# EAGLE design irisc (EAGLE 9.2.2)
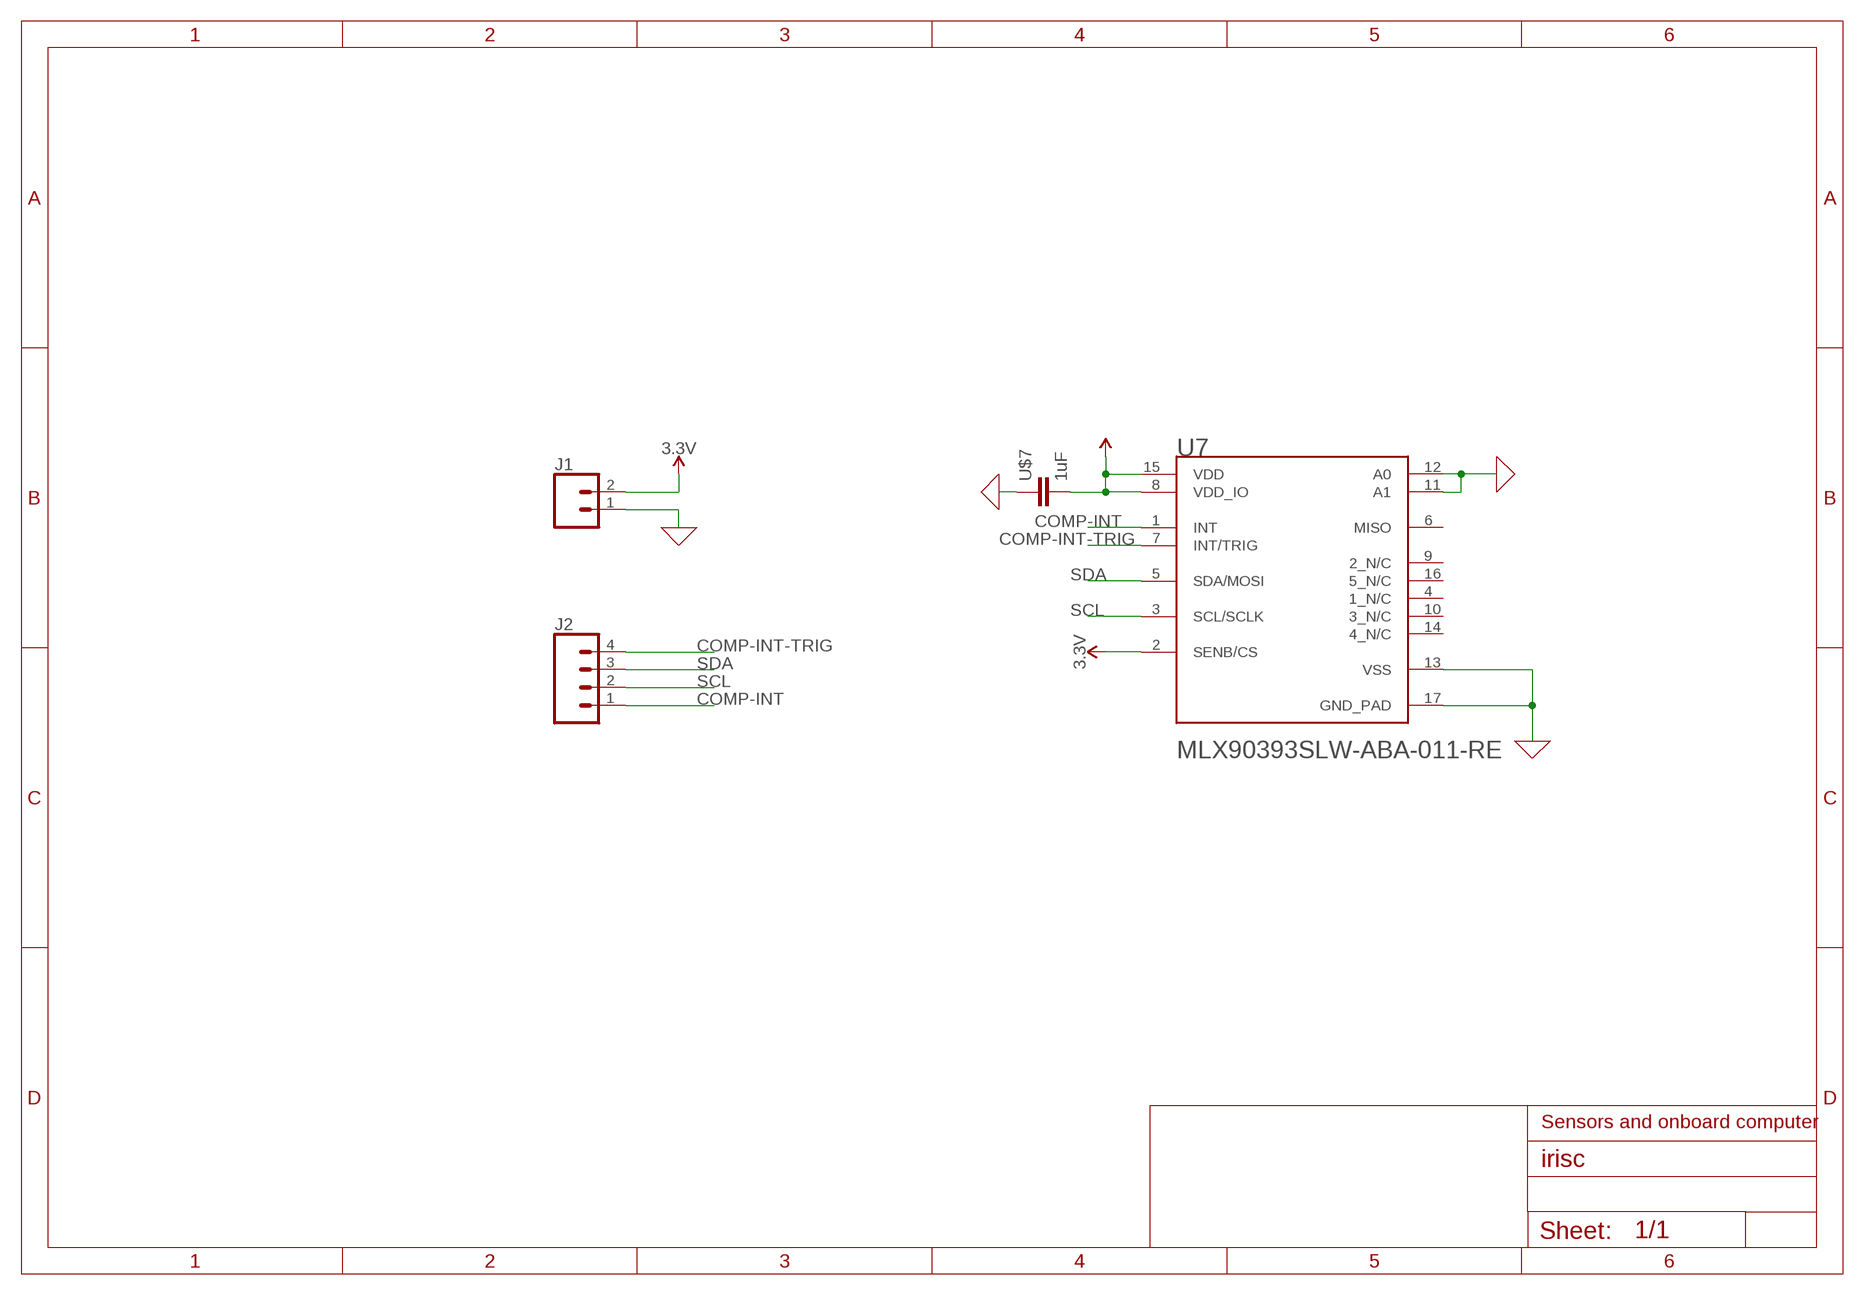
[diagram p0: schematic, sheet 1]

## Parts
J1  CONN_02  [1X02]
J2  CONN_04  [1X04]
U7  MELEXIS_TECHNOLOGIES_MLX90393SLW-ABA-011-REMELEXIS_TECHNOLOGIES_MLX90393SLW-ABA-011-RE_0_0  [MELEXIS_TECHNOLOGIES_MLX90393SLW-ABA-011-RE_0]
U$7  1uF  CAPACITOR_0603_N  [RESC0603_N]

## Nets
0: J1.1 U7.11(A1) U7.12(A0) U7.13(VSS) U7.17(GND_PAD) U$7.1 ; supply symbol labelled GND
3.3V: J1.2 U7.2(SENB/CS) U7.8(VDD_IO) U7.15(VDD) U$7.2
COMP-INT: J2.1 U7.1(INT)
COMP-INT-TRIG: J2.4 U7.7(INT/TRIG)
SCL: J2.2 U7.3(SCL/SCLK)
SDA: J2.3 U7.5(SDA/MOSI)
Unconnected: U7.4(1_N/C) U7.6(MISO) U7.9(2_N/C) U7.10(3_N/C) U7.14(4_N/C) U7.16(5_N/C)

## Notes on the sheet
- Sensors and onboard computer

## Library data of the parts
J1 = SparkFun-Connectors:CONN_02: Multi connection point. Often used as Generic Header-pin footprint for 0.1 inch spaced/style header connections On any of the 0.1 inch spaced packages, you can populate with these: Break Away Headers - Straight <https://www.sparkfun.com/products/116> (PRT-00116) Break Away Male Headers - Right Angle <https://www.sparkfun.com/products/553> (PRT-00553) Female Headers <https://www.sparkfun.com/products/115> (PRT-00115) Break Away Headers - Machine Pin <https://www.sparkfun.com/products/117> (PRT-00117) Break Away Female Headers - Swiss Machine Pin <https://www.sparkfun.com/products/743> (PRT-00743) For SCREWTERMINALS and SPRING TERMINALS visit here: Screw Terimnals on SparkFun.com <https://www.sparkfun.com/search/results?term=Screw+Terminals> (5mm/3.5mm/2.54mm spacing) This device is also useful as a general connection point to wire up your design to another part of your project. Our various solder wires solder well into these plated through hole pads. Hook-Up Wire - Assortment (Stranded, 22 AWG) <https://www.sparkfun.com/products/11375> (PRT-11375) Hook-Up Wire - Assortment (Solid Core, 22 AWG) <https://www.sparkfun.com/products/11367> (PRT-11367) View the entire wire category on our website here <https://www.sparkfun.com/categories/141> Special notes: Molex polarized connector foot print use with: PRT-08233 with associated crimp pins and housings. 2.54_SCREWTERM for use with PRT-10571. 3.5mm Screw Terminal footprints for PRT-08084 5mm Screw Terminal footprints for use with PRT-08432
J2 = SparkFun-Connectors:CONN_04: Multi connection point. Often used as Generic Header-pin footprint for 0.1 inch spaced/style header connections On any of the 0.1 inch spaced packages, you can populate with these: Break Away Headers - Straight <https://www.sparkfun.com/products/116> (PRT-00116) Break Away Male Headers - Right Angle <https://www.sparkfun.com/products/553> (PRT-00553) Female Headers <https://www.sparkfun.com/products/115> (PRT-00115) Break Away Headers - Machine Pin <https://www.sparkfun.com/products/117> (PRT-00117) Break Away Female Headers - Swiss Machine Pin <https://www.sparkfun.com/products/743> (PRT-00743) For SCREWTERMINALS and SPRING TERMINALS visit here: Screw Terimnals on SparkFun.com <https://www.sparkfun.com/search/results?term=Screw+Terminals> (5mm/3.5mm/2.54mm spacing) This device is also useful as a general connection point to wire up your design to another part of your project. Our various solder wires solder well into these plated through hole pads. Hook-Up Wire - Assortment (Stranded, 22 AWG) <https://www.sparkfun.com/products/11375> (PRT-11375) Hook-Up Wire - Assortment (Solid Core, 22 AWG) <https://www.sparkfun.com/products/11367> (PRT-11367) View the entire wire category on our website here <https://www.sparkfun.com/categories/141> Special notes: Molex polarized connector foot print use with SKU : PRT-08231 with associated crimp pins and housings. 1MM SMD Version SKU: PRT-10208; PROD_ID: CONN-09696
U7 = Melexis Technologies - MLX90393SLW-ABA-011-RE:MELEXIS_TECHNOLOGIES_MLX90393SLW-ABA-011-RE: Micropower Triaxis Magnetometer Datasheet; DATASHEET: https://www.melexis.com/-/media/files/documents/datasheets/mlx90393-datasheet-melexis.pdf; DIGIKEY_DESCRIPTION: IC Hall Effect Sensor X, Y, Z Axis 16-QFN (3x3); DIGIKEY_PART_NUMBER: MLX90393SLW-ABA-011-RECT-ND; IPC_LAND_PATTERN_NAME: QFN50P300X300X90-16; LEAD_FREE: yes; MF: Melexis Technologies; MOUSER_PART_NUMBER: 482-90393SLWABA011RE; MPN: MLX90393SLW-ABA-011-RE; PACKAGE: QFN-16; PREFIX: U; ROHS: yes; TEMPERATURE_RANGE_HIGH: +85°C; TEMPERATURE_RANGE_LOW: -20°C
U$7 = Nordic_nRF:CAPACITOR: Generic chip capacitor

## Board
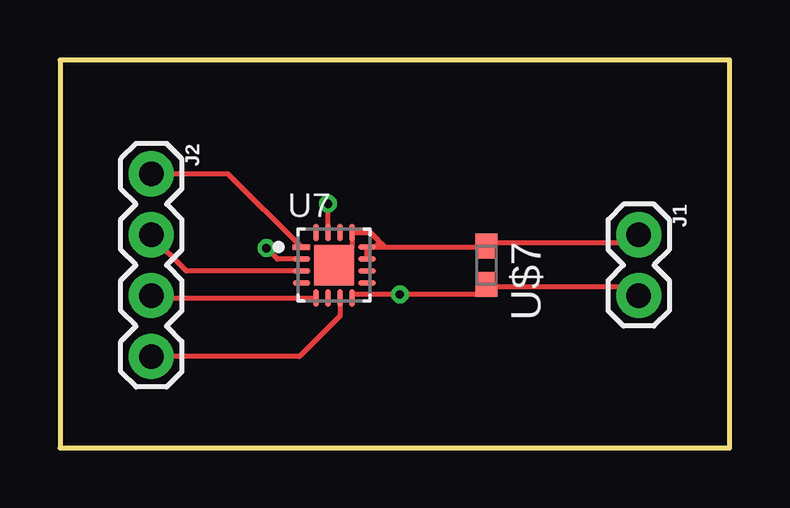
[diagram p1: board, top side]
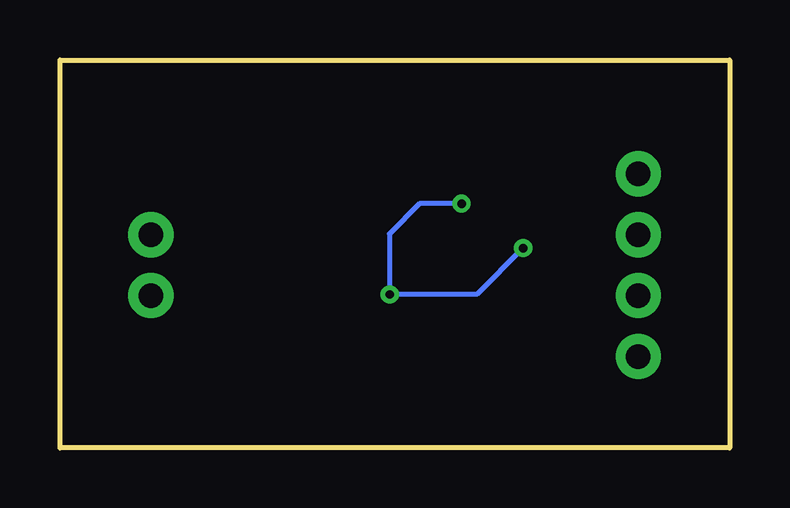
[diagram p2: board, bottom side, seen from below]

Size 27.92 x 16.18 mm. Coordinates in mm from the lower left corner, seen from the top.
Outline: 0,0 27.92,0 27.92,16.18 0,16.18 0,0
Copper layers (1*16): Top 0.035mm / dielectric 1.5mm / Bottom 0.035mm
Design rules "default": minimum track width 6mil, minimum drill 0.35mm, track to track 6mil, track to pad 6mil, pad to pad 6mil, via to via 6mil, smd to smd 6mil, copper to edge 40mil, drill to drill 6mil, minimum pad ring 10mil, minimum via ring 8mil, stop-mask expansion 4mil, vias tented up to drill 0mil, thermal gap 10mil

### Footprints (pad centres in the part's own frame; a part is rotated, then mirrored left to right if it is on the bottom)
1X02 = drill 1.016 pad 1.88: 1 0,0; 2 2.54,0
1X04 = drill 1.016 pad 1.88: 1 0,0; 2 2.54,0; 3 5.08,0; 4 7.62,0
MELEXIS_TECHNOLOGIES_MLX90393SLW-ABA-011-RE_0 = smd 0.74 x 0.239: 1 -1.366,0.75; 2 -1.366,0.25; 3 -1.366,-0.25; 4 -1.366,-0.75; 9 1.366,-0.75; 10 1.366,-0.25; 11 1.366,0.25; 12 1.366,0.75 | smd 0.239 x 0.74: 5 -0.75,-1.366; 6 -0.25,-1.366; 7 0.25,-1.366; 8 0.75,-1.366; 13 0.75,1.365; 14 0.25,1.365; 15 -0.25,1.365; 16 -0.75,1.365 | smd 1.675 x 1.675: 17 0,0
RESC0603_N = smd 1.05 x 0.9: 1 -0.8,0; 2 0.8,0

### Placement (x,y rotation side)
J1  24.13,8.89 270 top
J2  3.81,11.43 270 top
U7  11.43,7.62 0 top
U$7  17.78,7.62 270 top

### Tracks (layer width: path | path; a pad name or v marks a point on that pad's centre or on a via)
0
  Top 0.2: 17.83,8.53 23.77,8.53 J1.1 | 17.83,8.53 U$7.1 | 11.68,7.87 U7.17 12.18,8.37 U7.13 12.95,8.98 13.27,8.67 | U7.11 U7.12 13.14,8.37 | 13.14,8.37 13.5,8.37 | 13.5,8.37 17.67,8.37 17.83,8.53 | 13.5,8.37 13.5,8.43 13.27,8.67 | 13.27,8.67 13.27,8.49 13.14,8.37
  Bottom 0.2: J1.1 23.62,8.38
  pour Top (isolate 1.27): -0.42,-0.5 28.21,-0.5 28.28,-0.42
3.3V  (via drill 0.35)
  Top 0.2: U7.8 12.19,6.4 v14.17,6.4 17.37,6.4 17.68,6.71 U$7.2 17.83,6.71 23.77,6.71 J1.2 | U7.2 9.07,7.87 v8.61,8.33 | U7.15 v11.18,10.18 v11.18,10.19
  Bottom 0.2: v8.61,8.33 10.54,6.4 v14.17,6.4 14.19,6.41 14.19,8.93 12.93,10.19 v11.18,10.19
COMP-INT
  Top 0.2: 10.06,8.38 U7.1 7,11.43 J2.1
COMP-INT-TRIG
  Top 0.2: U7.7 11.68,5.51 9.98,3.81 J2.4
SCL
  Top 0.2: J2.2 3.81,8.84 5.28,7.37 U7.3
SDA
  Top 0.2: U7.5 10.67,6.25 3.81,6.25 J2.3